# EAGLE design Motor (EAGLE 6.5.0)
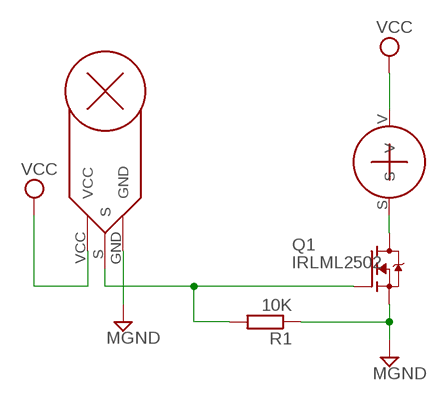
[diagram p0: schematic, sheet 1]

## Parts
Q1  IRLML2502  [SOT23-3]
R1  10K  R-EU_R0805  [R0805]
U$1  MOTOR  [MOTOR]
U$2  MOTOR-BOARDBOARD  [MOTOR-BOARD]

## Nets
GND2: Q1.2(S) R1.1 U$2.GND ; supply symbol labelled MGND
N$1: Q1.1(G) R1.2 U$2.S
N$13: Q1.3(D) U$1.S
VCC: U$1.V U$2.VCC

## Library data of the parts
Q1 = xmaker:IRLML2502: International Rectifier N-MOSFET.
R1 = resistor:R-EU_: RESISTOR, European symbol
U$1 = Mini-Q:MOTOR
U$2 = Mini-Q:MOTOR-BOARD

## Board
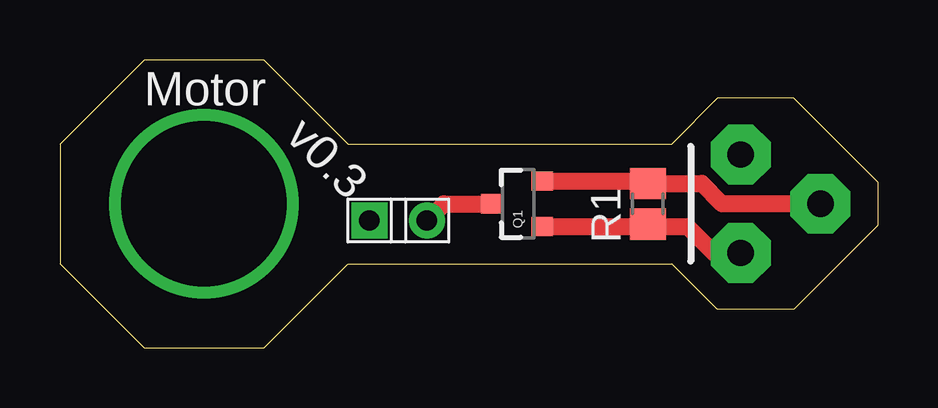
[diagram p1: board, top side]
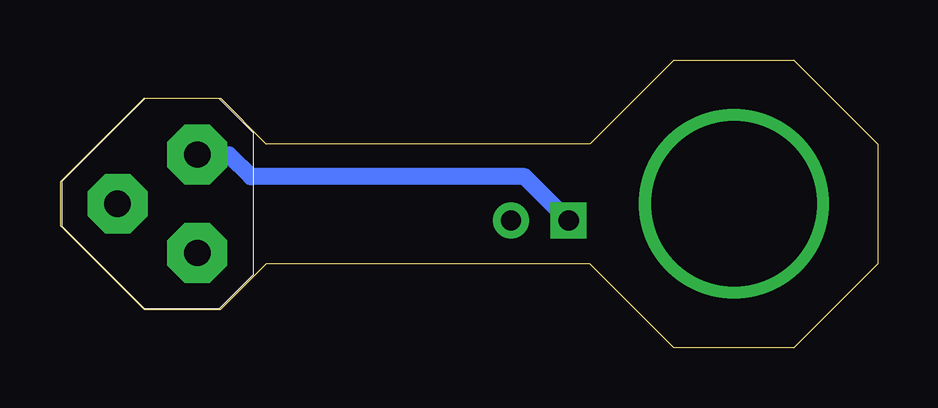
[diagram p2: board, bottom side, seen from below]

Size 34.1 x 12 mm. Coordinates in mm from the lower left corner, seen from the top.
Outline: 3.5,0 8.5,0 12,3.5 25.5,3.5 27.4,1.6 30.6,1.6 34.1,5.1 34.1,6.9 30.6,10.4 27.4,10.4 25.5,8.5 12,8.5 8.5,12 3.5,12 0,8.5 0,3.5 3.5,0
Copper layers (1*16): Top 0.035mm / dielectric 1.5mm / Bottom 0.035mm
Design rules "default": minimum track width 10mil, minimum drill 24mil, track to track 8mil, track to pad 8mil, pad to pad 8mil, via to via 8mil, smd to smd 8mil, copper to edge 40mil, drill to drill 8mil, minimum pad ring 10mil, minimum via ring 8mil, stop-mask expansion 4mil, vias tented up to drill 0mil, thermal gap 10mil

### Footprints (pad centres in the part's own frame; a part is rotated, then mirrored left to right if it is on the bottom)
SOT23-3 = smd 0.8 x 0.9: 1 -0.95,-1; 2 0.95,-1; 3 0,1.1
R0805 = smd 1.3 x 1.5: 1 -0.85,0; 2 0.85,0
MOTOR = drill 0.85 pad 1.5: S 1.2,0 | drill 0.85 pad 1.5 square: V -1.2,0
MOTOR-BOARD = drill 1.1 pad 2.5 octagon: GND 0,0; S -0.9,3.8; VCC -3.8,0.9

### Placement (x,y rotation side)
Q1  19.1,6 90 top
R1  24.5,6 270 top
U$1  14.1,5.3 0 top
U$2  31.7,6 225 bottom

### Tracks (layer width: path | path; a pad name or v marks a point on that pad's centre or on a via)
GND2
  Top 0.7: Q1.2 24.7,6.95 R1.1 26.75,6.85 27.6,6 U$2.GND
N$1
  Top 0.7: Q1.1 24.7,5.05 | 24.7,5.05 R1.2 | 24.7,5.05 26.15,5.05 27.25,3.95 U$2.S
N$2  (via drill 6.9)
  other vias: 6,6
N$13
  Top 0.7: U$1.S 16,6 Q1.3
VCC
  Bottom 0.7: U$1.V 14.73,7.13 26.14,7.13 27.06,8.05 U$2.VCC

### Text on the board
tNames: Motor | v0.3